# Altium schematic sheet MCU.SchDoc
size A3; SheetNumber: 2; SheetTotal: 7
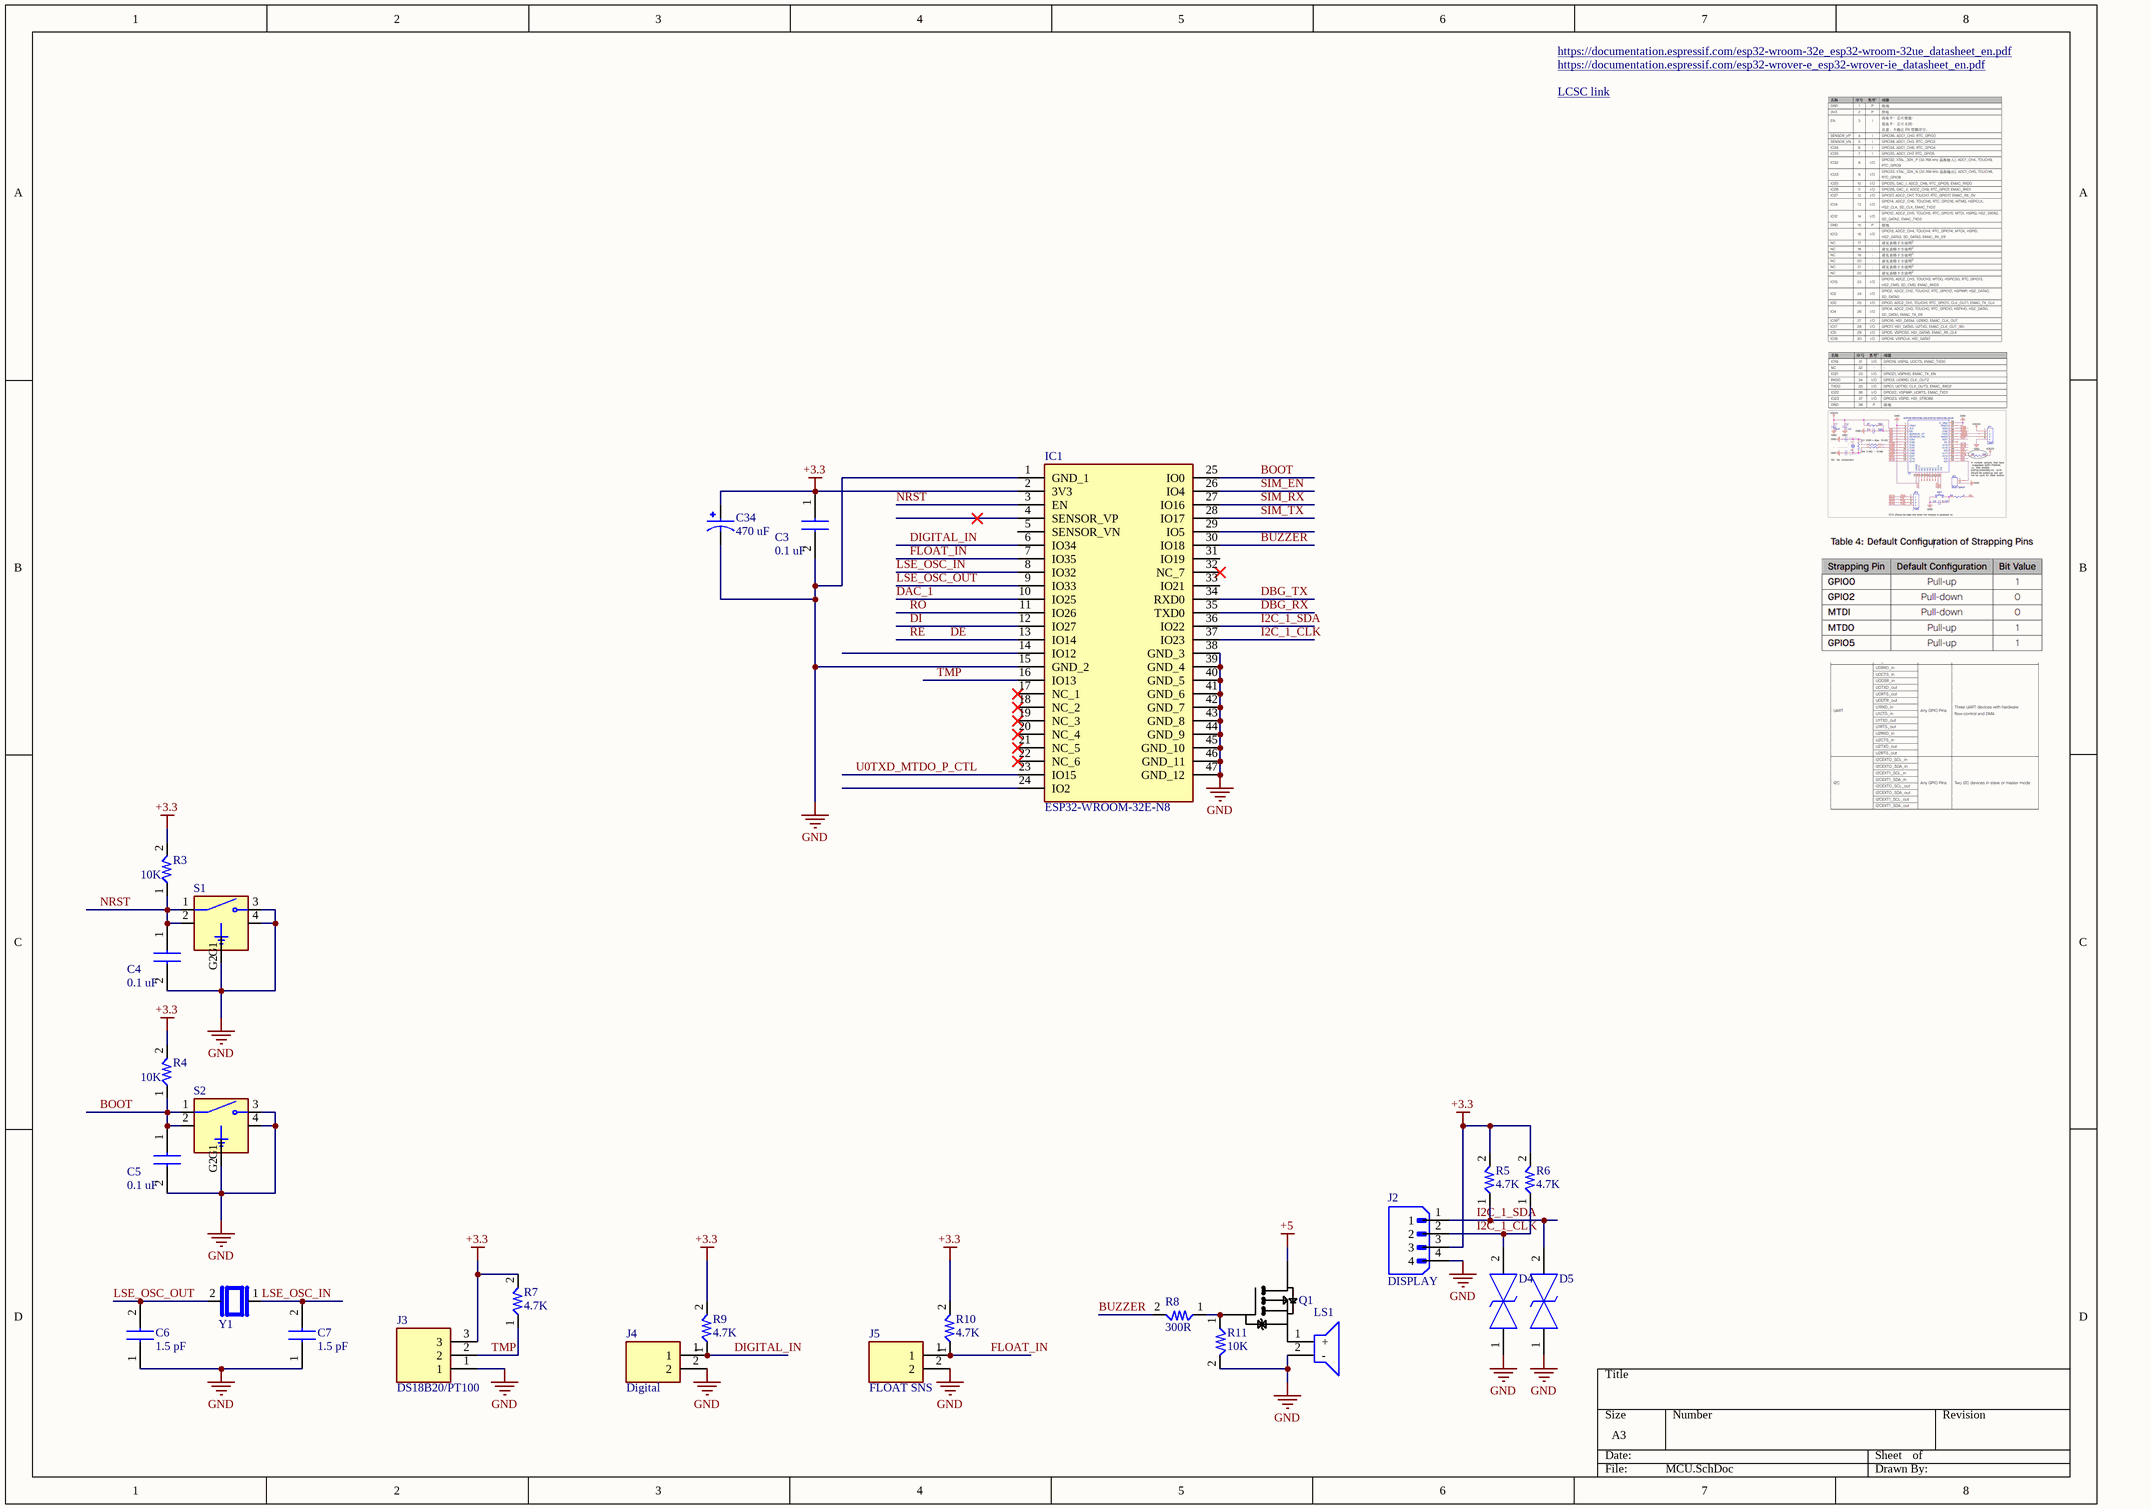
[diagram p0: MCU.SchDoc]

## Parts
C3  0.1 uF  [CAP0603]
C4  0.1 uF  [CAP0603]
C5  0.1 uF  [CAP0603]
C6  1.5 pF  [CAP0603]
C7  1.5 pF  [CAP0603]
C34  470 uF  [CAPPRD350W60D800H1150]
D4  DESD3V3Z1BCSF-7  [DESD3V3Z1BCSF7]  (value not drawn)
D5  DESD3V3Z1BCSF-7  [DESD3V3Z1BCSF7]  (value not drawn)
IC1  ESP32-WROOM-32E-N8  [ESP32WROOM32EN8]
J2  DISPLAY  [JST_B4B-XH-A(LF)(SN)]
J3  DS18B20/PT100  [2828153]
J4  Digital  [SHDRRA2W102P0X508_1X2_1016X1200X850P]
J5  FLOAT SNS  [SHDRRA2W102P0X508_1X2_1016X1200X850P]
LS1  CMI-1295IC-0585T  [CMI1295IC0585T]  (value not drawn)
Q1  DMG3415U-7  [SOT96P240X110-3N]  (value not drawn)
R3  10K  [RES0603]
R4  10K  [RES0603]
R5  4.7K  [RES0603]
R6  4.7K  [RES0603]
R7  4.7K  [RES0603]
R8  300R  [RES0603]
R9  4.7K  [RES0603]
R10  4.7K  [RES0603]
R11  10K  [RES0603]
S1  PTS526_SMG15_SMTR2_LFS  [SW_PTS526_SMG15_SMTR2_LFS]  (value not drawn)
S2  PTS526_SMG15_SMTR2_LFS  [SW_PTS526_SMG15_SMTR2_LFS]  (value not drawn)
Y1  CM8V-T1A-32.768KHZ-6PF-20PPM-TA-QC  [XTAL_CM8V-T1A-32.768KHZ-6PF-20PPM-TA-QC]  (value not drawn)

## Nets
+3.3: C3.1 C34.P IC1.2(3V3) J2.3 J3.3 R3.2 R4.2 R5.2 R6.2 R7.2 R9.2 R10.2
+5: Q1.3(D)
GND: C3.2 C4.2 C5.2 C6.1 C7.1 C34.N D4.1 D5.1 IC1.1(GND_1) IC1.15(GND_2) IC1.38(GND_3) IC1.39(GND_4) IC1.40(GND_5) IC1.41(GND_6) IC1.42(GND_7) IC1.43(GND_8) IC1.44(GND_9) IC1.45(GND_10) IC1.46(GND_11) IC1.47(GND_12) J2.4 J3.1 J4.2 J5.2 LS1.2(-) R11.2 S1.3(NO) S1.4(NO) S1.G2(GND) S2.3(NO) S2.4(NO) S2.G2(GND)
BOOT: C5.1 IC1.25(IO0) R4.1 S2.1(COM) S2.2(COM)
BUZZER: IC1.30(IO18) R8.2
DAC_1: IC1.10(IO25)
DBG_RX: IC1.35(TXD0)
DBG_TX: IC1.34(RXD0)
DE: IC1.13(IO14)  [also labelled RE]
DI: IC1.12(IO27)
DIGITAL_IN: IC1.6(IO34) J4.1 R9.1
FLOAT_IN: IC1.7(IO35) J5.1 R10.1
I2C_1_CLK: D4.2 IC1.37(IO23) J2.2 R6.1
I2C_1_SDA: D5.2 IC1.36(IO22) J2.1 R5.1
LSE_OSC_IN: C7.2 IC1.8(IO32) Y1.1
LSE_OSC_OUT: C6.2 IC1.9(IO33) Y1.2
NRST: C4.1 IC1.3(EN) R3.1 S1.1(COM) S1.2(COM)
RO: IC1.11(IO26)
SIM_EN: IC1.26(IO4)
SIM_RX: IC1.27(IO16)
SIM_TX: IC1.28(IO17)
TMP: IC1.16(IO13) J3.2 R7.1
U0TXD_MTDO_P_CTL: IC1.23(IO15)
NetLS1_1: LS1.1(+) Q1.2(S)
NetQ1_1: Q1.1(G) R8.1 R11.1

Not connected (* = marked no-connect by the designer): IC1 4(SENSOR_VP)* 5(SENSOR_VN) 14(IO12) 17(NC_1)* 18(NC_2)* 19(NC_3)* 20(NC_4)* 21(NC_5)* 22(NC_6)* 24(IO2) 29(IO5) 31(IO19) 32(NC_7)* 33(IO21); S1 G1(GND); S2 G1(GND)

## Notes on the sheet
- https://documentation.espressif.com/esp32-wroom-32e_esp32-wroom-32ue_datasheet_en.pdf
- https://documentation.espressif.com/esp32-wrover-e_esp32-wrover-ie_datasheet_en.pdf
- LCSC link <https://www.lcsc.com/product-detail/C701342.html?s_z=n_q_t_esp32&spm=wm.fly.bg.3.xh___wm.ssy.tc.0.tz&lcsc_vid=EVJdVVYDQlEPAgBWRwALVwJWFlQKUQJQQwdXUVRSQFIxVlNeRlBXXlJfTlRXVDsOAxUeFF5JWBYZEEoKFBINSQcJGk4dAgUUFAk%3D>

## Library data of the parts
C3-C7 = CC0603KRX7R9BB104: Capacitor; Manufacturer_Name: YAGEO; Datasheet Link: https://componentsearchengine.com/Datasheets/2/CC0603KRX7R9BB104.pdf; Height: 0.9mm; Manufacturer_Part_Number: CC0603KRX7R9BB104; Mouser Part Number: 603-CC603KRX7R9BB104; Mouser Price/Stock: https://www.mouser.co.uk/ProductDetail/YAGEO/CC0603KRX7R9BB104?qs=vTakOoo5QyLvVCYM2ge8LQ%3D%3D; Arrow Part Number: CC0603KRX7R9BB104; Arrow Price/Stock: https://www.arrow.com/en/products/cc0603krx7r9bb104/yageo?utm_currency=USD&region=europe
C34 = EEUFC1E221: 220F 25V Aluminum Electrolytic Capacitors Radial, Can 2000 Hrs @ 105C; MF: Panasonic; Package: RADIAL-2 Panasonic; Price: None; Purchase-URL: https://pricing.snapeda.com/search/part/EEUFC1E221/?ref=eda; Value: *; Check_prices: https://www.snapeda.com/parts/EEUFC1E221/Panasonic/view-part/?ref=eda; MP: EEUFC1E221; SnapEDA_Link: https://www.snapeda.com/parts/EEUFC1E221/Panasonic/view-part/?ref=snap; Availability: In Stock
D4 D5 = DESD3V3Z1BCSF-7: TVS Diode (Bi-directional); Manufacturer_Name: Diodes Incorporated; Datasheet Link: https://www.diodes.com/assets/Package-Files/X2-WLB0603-2.pdf; Height: 0.32mm; Manufacturer_Part_Number: DESD3V3Z1BCSF-7; Mouser Part Number: 621-DESD3V3Z1BCSF-7; Mouser Price/Stock: https://www.mouser.co.uk/ProductDetail/Diodes-Incorporated/DESD3V3Z1BCSF-7?qs=HXFqYaX1Q2xS5VnKZuyjmg%3D%3D; Arrow Part Number: DESD3V3Z1BCSF-7; Arrow Price/Stock: https://www.arrow.com/en/products/desd3v3z1bcsf-7/diodes-incorporated?utm_currency=USD&region=nac
IC1 = ESP32-WROOM-32E-N8: Integrated Circuit; Manufacturer_Name: Espressif Systems; Datasheet Link: https://www.google.com/url?sa=t&rct=j&q=&esrc=s&source=web&cd=&ved=2ahUKEwjLw4ysybv2AhXFzIUKHZUbB64QFnoECCwQAQ&url=https%3A%2F%2Fwww.espressif.com%2Fsites%2Fdefault%2Ffiles%2Fdocumentation%2Fesp32-wroom-32e_esp32-wroom-32ue_datasheet_en.pdf&usg=AOvVaw1xSL; Height: 3.25mm; Manufacturer_Part_Number: ESP32-WROOM-32E-N8; Mouser Part Number: 356-ESP32WRM32E164PH; Mouser Price/Stock: https://www.mouser.co.uk/ProductDetail/Espressif-Systems/ESP32-WROOM-32E-N8?qs=Li%252BoUPsLEnsLnZW%252BGLgUhw%3D%3D
J2 = B4B-XH-A(LF)(SN): Connector Header Through Hole 4 position 0.098 (2.50mm); MF: JST Sales; SnapEDA_Link: https://www.snapeda.com/parts/B4B-XH-A(LF)(SN)/JST+Sales+America+Inc./view-part/?ref=snap; Package: None; Value: *; MP: B4B-XH-A(LF)(SN); Check_prices: https://www.snapeda.com/parts/B4B-XH-A(LF)(SN)/JST+Sales+America+Inc./view-part/?ref=eda
J3 = 282815-3: Connector; Manufacturer_Name: TE Connectivity; Datasheet Link: https://www.te.com/commerce/DocumentDelivery/DDEController?Action=srchrtrv&DocNm=1-773958-1&DocType=Data%20Sheet&DocLang=English&PartCntxt=282815-3&DocFormat=pdf; Height: 8.35mm; Manufacturer_Part_Number: 282815-3; Mouser Part Number: 571-282815-3; Mouser Price/Stock: https://www.mouser.co.uk/ProductDetail/TE-Connectivity/282815-3?qs=79%2FjLZ2kXkqd6grVMiPYfw%3D%3D; Arrow Part Number: 282815-3; Arrow Price/Stock: https://www.arrow.com/en/products/282815-3/te-connectivity
J4 J5 = 282815-2: Connector; Manufacturer_Name: TE Connectivity; Datasheet Link: https://www.te.com/commerce/DocumentDelivery/DDEController?Action=srchrtrv&DocNm=1-773958-1&DocType=Data%20Sheet&DocLang=English&PartCntxt=282815-2&DocFormat=pdf; Height: 8.5mm; Manufacturer_Part_Number: 282815-2; Mouser Part Number: 571-282815-2; Mouser Price/Stock: https://www.mouser.co.uk/ProductDetail/TE-Connectivity/282815-2?qs=79%2FjLZ2kXkpF7MFURi982A%3D%3D; Arrow Part Number: 282815-2; Arrow Price/Stock: https://www.arrow.com/en/products/282815-2/te-connectivity?region=nac
LS1 = CMI-1295IC-0585T: Loudspeaker or Buzzer; Manufacturer_Name: Same Sky; Datasheet Link: https://www.sameskydevices.com/product/resource/CMI-1295IC-0585T.pdf; Height: 9.7mm; Manufacturer_Part_Number: CMI-1295IC-0585T; Mouser Part Number: 490-CMI-1295IC-0585T; Mouser Price/Stock: https://www.mouser.co.uk/ProductDetail/Same-Sky/CMI-1295IC-0585T?qs=OlC7AqGiEDkuskN%2Fok3iNw%3D%3D; Arrow Part Number: CMI-1295IC-0585T; Arrow Price/Stock: https://www.arrow.com/en/products/cmi-1295ic-0585t/cui-devices?utm_currency=USD&region=nac
Q1 = DMG3415U-7: Integrated Circuit; Manufacturer_Name: Lattice Semiconductor; Datasheet Link: https://media.digikey.com/pdf/Data%20Sheets/Diodes%20PDFs/DMG3415U.pdf; Height: 1.1mm; Manufacturer_Part_Number: DMG3415U-7; Mouser Part Number: N/A; Mouser Price/Stock: https://www.mouser.com/Search/Refine.aspx?Keyword=N%2FA
R3-R11 = RES: Resistor; Manufacturer_Name: UNI-ROYAL(Uniroyal Elec); Manufacturer_Part_Number: 0603WAF1001T5E; Datasheet Link: https://datasheet.lcsc.com/szlcsc/Uniroyal-Elec-0603WAF1001T5E_C21190.pdf; Height: 0.55mm
S1 S2 = PTS526_SMG15_SMTR2_LFS: Tactile Switch SPST-NO Top Actuated Surface Mount; MP: PTS526 SMG15 SMTR2 LFS; MF: C&K; Availability: In Stock; SnapEDA_Link: https://www.snapeda.com/parts/PTS526%20SMG15%20SMTR2%20LFS/C%2526K/view-part/?ref=snap; Value: *; Package: None; Price: None; Purchase-URL: https://pricing.snapeda.com/search/part/PTS526 SMG15 SMTR2 LFS/?ref=eda; Check_prices: https://www.snapeda.com/parts/PTS526%20SMG15%20SMTR2%20LFS/C%2526K/view-part/?ref=eda
Y1 = CM8V-T1A-32.768KHZ-6PF-20PPM-TA-QC: Tuning Fork Crystal 32.768kHz in SMD 1.2 x 2.0mm package; MF: Micro Crystal; SnapEDA_Link: https://www.snapeda.com/parts/CM8V-T1A-32.768kHz-6pF-20PPM-TA-QC/Micro+Crystal/view-part/?ref=snap; Package: SMD-2 Micro Crystal; Value: *; MP: CM8V-T1A-32.768kHz-6pF-20PPM-TA-QC; Check_prices: https://www.snapeda.com/parts/CM8V-T1A-32.768kHz-6pF-20PPM-TA-QC/Micro+Crystal/view-part/?ref=eda